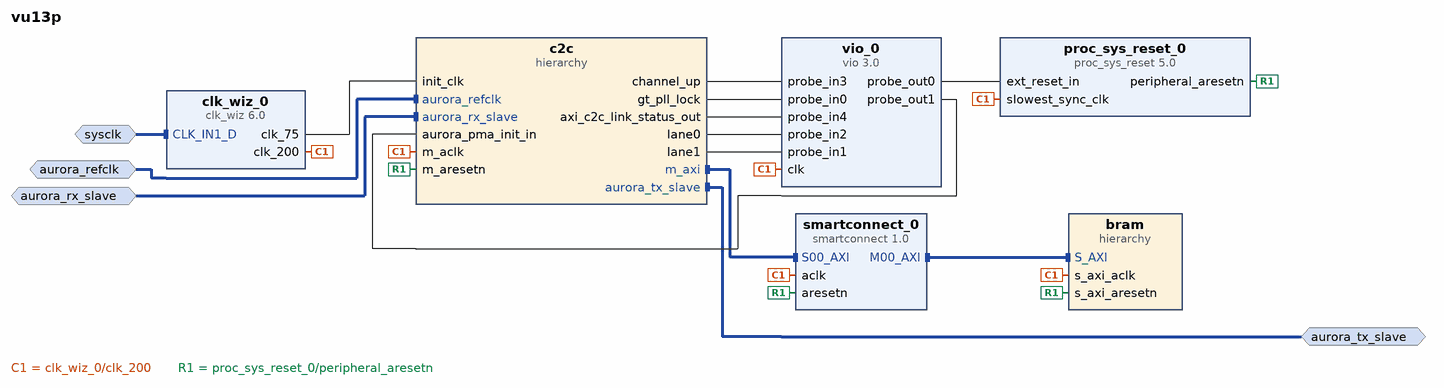
[diagram p0: block diagram of the top level]
# Vivado block design vu13p, xcvu13p-fhgb2104-2-e, Vivado 2022.2
create_bd_design vu13p

create_bd_intf_port -mode Slave -vlnv xilinx.com:interface:diff_clock_rtl:1.0 aurora_refclk
set_property -dict {CONFIG.FREQ_HZ 156250000} [get_bd_intf_ports aurora_refclk]
create_bd_intf_port -mode Slave -vlnv xilinx.com:display_aurora:GT_Serial_Transceiver_Pins_RX_rtl:1.0 aurora_rx_slave
create_bd_intf_port -mode Master -vlnv xilinx.com:display_aurora:GT_Serial_Transceiver_Pins_TX_rtl:1.0 aurora_tx_slave
create_bd_intf_port -mode Slave -vlnv xilinx.com:interface:diff_clock_rtl:1.0 sysclk

create_bd_cell -type hier bram
create_bd_cell -type hier c2c
create_bd_cell -type ip -vlnv xilinx.com:ip:clk_wiz:6.0 clk_wiz_0
set_property -dict [list \
  CONFIG.CLKOUT1_JITTER 102.086 \
  CONFIG.CLKOUT1_PHASE_ERROR 87.180 \
  CONFIG.CLKOUT1_REQUESTED_OUT_FREQ 200.000 \
  CONFIG.CLKOUT2_JITTER 122.158 \
  CONFIG.CLKOUT2_PHASE_ERROR 87.180 \
  CONFIG.CLKOUT2_REQUESTED_OUT_FREQ 75 \
  CONFIG.CLKOUT2_USED true \
  CONFIG.CLK_OUT1_PORT clk_200 \
  CONFIG.CLK_OUT2_PORT clk_75 \
  CONFIG.MMCM_CLKFBOUT_MULT_F 12.000 \
  CONFIG.MMCM_CLKOUT0_DIVIDE_F 6.000 \
  CONFIG.MMCM_CLKOUT1_DIVIDE 16 \
  CONFIG.NUM_OUT_CLKS 2 \
  CONFIG.PRIM_SOURCE Differential_clock_capable_pin \
  CONFIG.USE_LOCKED false \
  CONFIG.USE_RESET false \
] [get_bd_cells clk_wiz_0]
create_bd_cell -type ip -vlnv xilinx.com:ip:proc_sys_reset:5.0 proc_sys_reset_0
create_bd_cell -type ip -vlnv xilinx.com:ip:smartconnect:1.0 smartconnect_0
set_property -dict {CONFIG.NUM_SI 1} [get_bd_cells smartconnect_0]
create_bd_cell -type ip -vlnv xilinx.com:ip:vio:3.0 vio_0
set_property -dict {CONFIG.C_NUM_PROBE_IN 5 CONFIG.C_NUM_PROBE_OUT 2 CONFIG.C_PROBE_OUT0_INIT_VAL 0x1} [get_bd_cells vio_0]

# ---- hierarchy /bram ----
current_bd_instance /bram
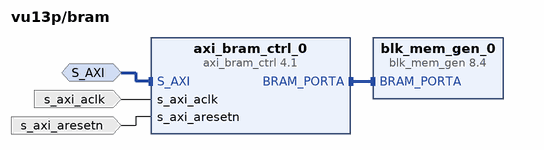
[diagram p1: block diagram inside /bram]
create_bd_intf_pin -mode Slave -vlnv xilinx.com:interface:aximm_rtl:1.0 S_AXI
create_bd_pin -dir I -type clk s_axi_aclk
create_bd_pin -dir I -type rst s_axi_aresetn

create_bd_cell -type ip -vlnv xilinx.com:ip:axi_bram_ctrl:4.1 axi_bram_ctrl_0
set_property -dict {CONFIG.DATA_WIDTH 64 CONFIG.SINGLE_PORT_BRAM 1} [get_bd_cells axi_bram_ctrl_0]
create_bd_cell -type ip -vlnv xilinx.com:ip:blk_mem_gen:8.4 blk_mem_gen_0

# ---- hierarchy /c2c ----
current_bd_instance /c2c
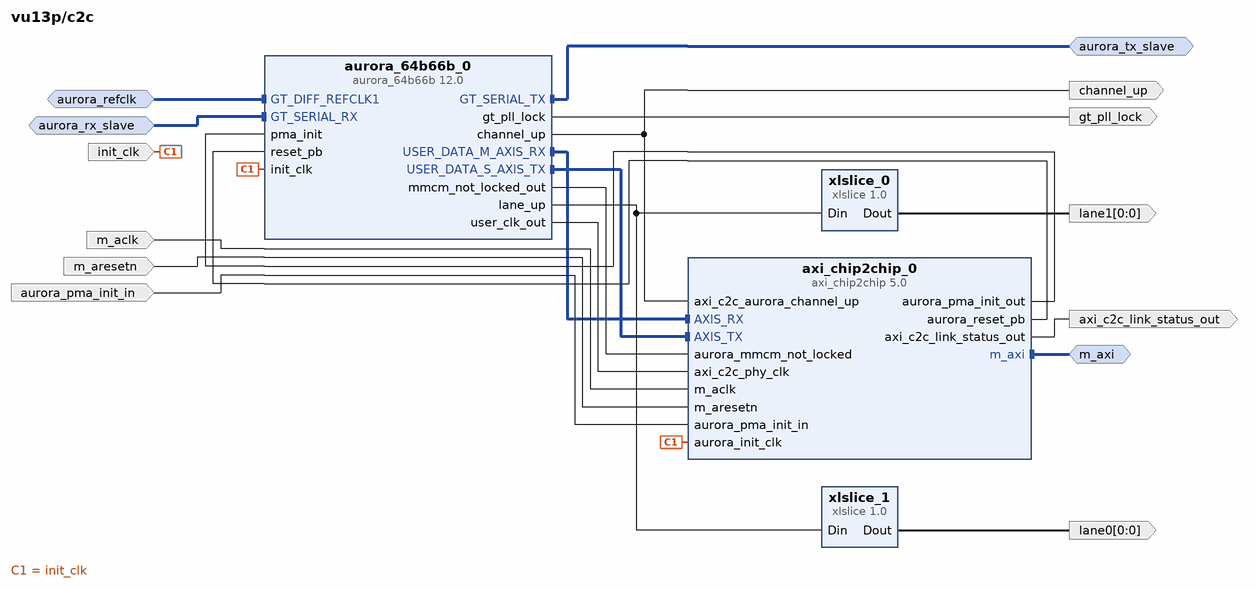
[diagram p2: block diagram inside /c2c]
create_bd_intf_pin -mode Slave -vlnv xilinx.com:interface:diff_clock_rtl:1.0 aurora_refclk
create_bd_intf_pin -mode Slave -vlnv xilinx.com:display_aurora:GT_Serial_Transceiver_Pins_RX_rtl:1.0 aurora_rx_slave
create_bd_intf_pin -mode Master -vlnv xilinx.com:display_aurora:GT_Serial_Transceiver_Pins_TX_rtl:1.0 aurora_tx_slave
create_bd_intf_pin -mode Master -vlnv xilinx.com:interface:aximm_rtl:1.0 m_axi
create_bd_pin -dir I -type rst aurora_pma_init_in
create_bd_pin -dir O axi_c2c_link_status_out
create_bd_pin -dir O channel_up
create_bd_pin -dir O gt_pll_lock
create_bd_pin -dir I -type clk init_clk
create_bd_pin -dir O -from 0 -to 0 lane0
create_bd_pin -dir O -from 0 -to 0 lane1
create_bd_pin -dir I -type clk m_aclk
create_bd_pin -dir I -type rst m_aresetn

create_bd_cell -type ip -vlnv xilinx.com:ip:aurora_64b66b:12.0 aurora_64b66b_0
set_property -dict [list \
  CONFIG.C_AURORA_LANES 2 \
  CONFIG.C_INIT_CLK 75 \
  CONFIG.C_LINE_RATE 6.25 \
  CONFIG.C_REFCLK_FREQUENCY 156.25 \
  CONFIG.C_REFCLK_SOURCE MGTREFCLK1_of_Quad_X0Y4 \
  CONFIG.C_UCOLUMN_USED left \
  CONFIG.C_USE_BYTESWAP true \
  CONFIG.SupportLevel 1 \
  CONFIG.drp_mode Disabled \
  CONFIG.interface_mode Streaming \
] [get_bd_cells aurora_64b66b_0]
create_bd_cell -type ip -vlnv xilinx.com:ip:axi_chip2chip:5.0 axi_chip2chip_0
set_property -dict [list \
  CONFIG.C_AXI_ADDR_WIDTH 40 \
  CONFIG.C_AXI_DATA_WIDTH 64 \
  CONFIG.C_INTERFACE_MODE 0 \
  CONFIG.C_INTERFACE_TYPE 2 \
  CONFIG.C_MASTER_FPGA 0 \
  CONFIG.C_M_AXI_ID_WIDTH 0 \
  CONFIG.C_M_AXI_WUSER_WIDTH 0 \
  CONFIG.C_SUPPORT_NARROWBURST true \
] [get_bd_cells axi_chip2chip_0]
create_bd_cell -type ip -vlnv xilinx.com:ip:xlslice:1.0 xlslice_0
set_property -dict {CONFIG.DIN_WIDTH 2} [get_bd_cells xlslice_0]
create_bd_cell -type ip -vlnv xilinx.com:ip:xlslice:1.0 xlslice_1
set_property -dict {CONFIG.DIN_FROM 1 CONFIG.DIN_TO 1 CONFIG.DIN_WIDTH 2} [get_bd_cells xlslice_1]

# ---- connections ----

current_bd_instance /bram
connect_bd_intf_net [get_bd_intf_pins axi_bram_ctrl_0/BRAM_PORTA] [get_bd_intf_pins blk_mem_gen_0/BRAM_PORTA]
connect_bd_intf_net -intf_net smartconnect_0_M00_AXI [get_bd_intf_pins S_AXI] [get_bd_intf_pins axi_bram_ctrl_0/S_AXI]
connect_bd_net -net clk_wiz_0_clk_200 [get_bd_pins s_axi_aclk] [get_bd_pins axi_bram_ctrl_0/s_axi_aclk]
connect_bd_net -net proc_sys_reset_0_peripheral_aresetn [get_bd_pins s_axi_aresetn] [get_bd_pins axi_bram_ctrl_0/s_axi_aresetn]

current_bd_instance /c2c
connect_bd_intf_net -intf_net GT_DIFF_REFCLK1_0_1 [get_bd_intf_pins aurora_refclk] [get_bd_intf_pins aurora_64b66b_0/GT_DIFF_REFCLK1]
connect_bd_intf_net -intf_net GT_SERIAL_RX_0_1 [get_bd_intf_pins aurora_rx_slave] [get_bd_intf_pins aurora_64b66b_0/GT_SERIAL_RX]
connect_bd_intf_net [get_bd_intf_pins aurora_tx_slave] [get_bd_intf_pins aurora_64b66b_0/GT_SERIAL_TX]
connect_bd_intf_net [get_bd_intf_pins aurora_64b66b_0/USER_DATA_M_AXIS_RX] [get_bd_intf_pins axi_chip2chip_0/AXIS_RX]
connect_bd_intf_net [get_bd_intf_pins aurora_64b66b_0/USER_DATA_S_AXIS_TX] [get_bd_intf_pins axi_chip2chip_0/AXIS_TX]
connect_bd_intf_net [get_bd_intf_pins m_axi] [get_bd_intf_pins axi_chip2chip_0/m_axi]
connect_bd_net [get_bd_pins aurora_64b66b_0/channel_up] [get_bd_pins channel_up] [get_bd_pins axi_chip2chip_0/axi_c2c_aurora_channel_up]
connect_bd_net [get_bd_pins aurora_64b66b_0/gt_pll_lock] [get_bd_pins gt_pll_lock]
connect_bd_net [get_bd_pins aurora_64b66b_0/lane_up] [get_bd_pins xlslice_0/Din] [get_bd_pins xlslice_1/Din]
connect_bd_net [get_bd_pins aurora_64b66b_0/mmcm_not_locked_out] [get_bd_pins axi_chip2chip_0/aurora_mmcm_not_locked]
connect_bd_net [get_bd_pins aurora_64b66b_0/user_clk_out] [get_bd_pins axi_chip2chip_0/axi_c2c_phy_clk]
connect_bd_net [get_bd_pins axi_chip2chip_0/aurora_pma_init_out] [get_bd_pins aurora_64b66b_0/pma_init]
connect_bd_net [get_bd_pins axi_chip2chip_0/aurora_reset_pb] [get_bd_pins aurora_64b66b_0/reset_pb]
connect_bd_net [get_bd_pins axi_chip2chip_0/axi_c2c_link_status_out] [get_bd_pins axi_c2c_link_status_out]
connect_bd_net -net clk_wiz_0_clk_156_25 [get_bd_pins init_clk] [get_bd_pins aurora_64b66b_0/init_clk] [get_bd_pins axi_chip2chip_0/aurora_init_clk]
connect_bd_net -net clk_wiz_0_clk_200 [get_bd_pins m_aclk] [get_bd_pins axi_chip2chip_0/m_aclk]
connect_bd_net -net proc_sys_reset_0_peripheral_aresetn [get_bd_pins m_aresetn] [get_bd_pins axi_chip2chip_0/m_aresetn]
connect_bd_net -net vio_0_probe_out1 [get_bd_pins aurora_pma_init_in] [get_bd_pins axi_chip2chip_0/aurora_pma_init_in]
connect_bd_net [get_bd_pins xlslice_0/Dout] [get_bd_pins lane1]
connect_bd_net [get_bd_pins xlslice_1/Dout] [get_bd_pins lane0]

current_bd_instance /
connect_bd_intf_net -intf_net CLK_IN1_D_0_1 [get_bd_intf_ports sysclk] [get_bd_intf_pins clk_wiz_0/CLK_IN1_D]
connect_bd_intf_net -intf_net GT_DIFF_REFCLK1_0_1 [get_bd_intf_ports aurora_refclk] [get_bd_intf_pins c2c/aurora_refclk]
connect_bd_intf_net -intf_net GT_SERIAL_RX_0_1 [get_bd_intf_ports aurora_rx_slave] [get_bd_intf_pins c2c/aurora_rx_slave]
connect_bd_intf_net -intf_net aurora_64b66b_0_GT_SERIAL_TX [get_bd_intf_ports aurora_tx_slave] [get_bd_intf_pins c2c/aurora_tx_slave]
connect_bd_intf_net -intf_net axi_chip2chip_0_m_axi [get_bd_intf_pins c2c/m_axi] [get_bd_intf_pins smartconnect_0/S00_AXI]
connect_bd_intf_net [get_bd_intf_pins bram/S_AXI] [get_bd_intf_pins smartconnect_0/M00_AXI]
connect_bd_net -net aurora_64b66b_0_channel_up [get_bd_pins c2c/channel_up] [get_bd_pins vio_0/probe_in3]
connect_bd_net -net aurora_64b66b_0_gt_pll_lock [get_bd_pins c2c/gt_pll_lock] [get_bd_pins vio_0/probe_in0]
connect_bd_net -net axi_chip2chip_0_axi_c2c_link_status_out [get_bd_pins c2c/axi_c2c_link_status_out] [get_bd_pins vio_0/probe_in4]
connect_bd_net -net c2c_Dout [get_bd_pins c2c/lane0] [get_bd_pins vio_0/probe_in2]
connect_bd_net -net c2c_Dout1 [get_bd_pins c2c/lane1] [get_bd_pins vio_0/probe_in1]
connect_bd_net -net clk_wiz_0_clk_156_25 [get_bd_pins clk_wiz_0/clk_75] [get_bd_pins c2c/init_clk]
connect_bd_net [get_bd_pins clk_wiz_0/clk_200] \
  [get_bd_pins bram/s_axi_aclk] [get_bd_pins c2c/m_aclk] [get_bd_pins proc_sys_reset_0/slowest_sync_clk] \
  [get_bd_pins smartconnect_0/aclk] [get_bd_pins vio_0/clk]
connect_bd_net [get_bd_pins proc_sys_reset_0/peripheral_aresetn] \
  [get_bd_pins bram/s_axi_aresetn] [get_bd_pins c2c/m_aresetn] [get_bd_pins smartconnect_0/aresetn]
connect_bd_net [get_bd_pins vio_0/probe_out0] [get_bd_pins proc_sys_reset_0/ext_reset_in]
connect_bd_net [get_bd_pins vio_0/probe_out1] [get_bd_pins c2c/aurora_pma_init_in]

# ---- address map ----
assign_bd_address -offset 0x00A0000000 -range 16K -target_address_space [get_bd_addr_spaces c2c/axi_chip2chip_0/MAXI] [get_bd_addr_segs bram/axi_bram_ctrl_0/S_AXI/Mem0]

validate_bd_design
save_bd_design
